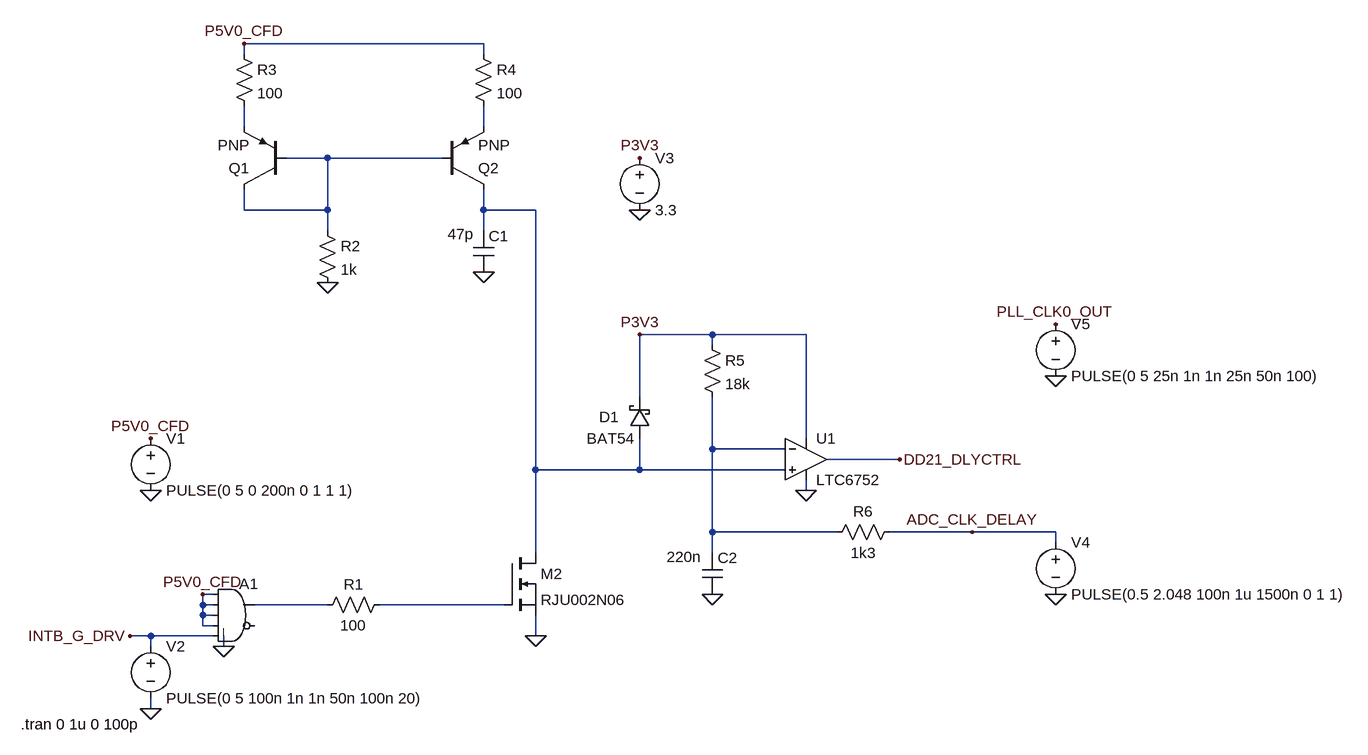
[diagram p0: schematic FIT_PM12_adc_delay.asc]
FIT_PM12_adc_delay.asc, the LTspice schematic file:
Version 4
SHEET 1 1948 680
WIRE 560 -720 192 -720
WIRE 192 -704 192 -720
WIRE 560 -704 560 -720
WIRE 192 -592 192 -624
WIRE 560 -592 560 -624
WIRE 320 -544 256 -544
WIRE 496 -544 320 -544
WIRE 192 -464 192 -496
WIRE 320 -464 320 -544
WIRE 320 -464 192 -464
WIRE 560 -464 560 -496
WIRE 640 -464 560 -464
WIRE 320 -432 320 -464
WIRE 560 -432 560 -464
WIRE 912 -272 800 -272
WIRE 1056 -272 912 -272
WIRE 912 -256 912 -272
WIRE 800 -176 800 -272
WIRE 1056 -112 1056 -272
WIRE 912 -96 912 -176
WIRE 1024 -96 912 -96
WIRE 1200 -80 1088 -80
WIRE 640 -64 640 -464
WIRE 800 -64 800 -112
WIRE 800 -64 640 -64
WIRE 1024 -64 800 -64
WIRE 1056 -32 1056 -48
WIRE 912 32 912 -96
WIRE 1104 32 912 32
WIRE 1312 32 1184 32
WIRE 1440 32 1312 32
WIRE 1440 48 1440 32
WIRE 640 64 640 -64
WIRE 912 64 912 32
WIRE 144 128 128 128
WIRE 128 144 128 128
WIRE 144 144 128 144
WIRE 320 144 208 144
WIRE 592 144 400 144
WIRE 128 160 128 144
WIRE 144 160 128 160
WIRE 128 176 128 160
WIRE 144 176 128 176
WIRE 48 192 16 192
WIRE 144 192 48 192
WIRE 640 192 640 160
WIRE 48 208 48 192
WIRE 160 208 160 192
WIRE 48 304 48 288
FLAG 160 208 0
FLAG 48 -32 0
FLAG 48 -112 P5V0_CFD
FLAG 128 128 P5V0_CFD
FLAG 16 192 INTB_G_DRV
FLAG 48 304 0
FLAG 640 192 0
FLAG 320 -352 0
FLAG 560 -368 0
FLAG 192 -720 P5V0_CFD
FLAG 800 -464 0
FLAG 800 -544 P3V3
FLAG 800 -272 P3V3
FLAG 1056 -32 0
FLAG 1200 -80 DD21_DLYCTRL
FLAG 912 128 0
FLAG 1312 32 ADC_CLK_DELAY
FLAG 1440 128 0
FLAG 1440 -208 0
FLAG 1440 -288 PLL_CLK0_OUT
SYMBOL Digital\\and 176 96 R0
SYMATTR InstName A1
SYMATTR SpiceLine Vhigh=5.0 Vlow=0 Ref=1.0 Td=2ns
SYMBOL voltage 48 -128 R0
WINDOW 123 0 0 Left 0
WINDOW 39 0 0 Left 0
SYMATTR InstName V1
SYMATTR Value PULSE(0 5 0 200n 0 1 1 1)
SYMBOL voltage 48 192 R0
WINDOW 123 0 0 Left 0
WINDOW 39 0 0 Left 0
SYMATTR InstName V2
SYMATTR Value PULSE(0 5 100n 1n 1n 50n 100n 20)
SYMBOL res 416 128 R90
WINDOW 0 0 56 VBottom 2
WINDOW 3 32 56 VTop 2
SYMATTR InstName R1
SYMATTR Value 100
SYMBOL pnp 256 -496 R180
SYMATTR InstName Q1
SYMBOL pnp 496 -496 M180
SYMATTR InstName Q2
SYMBOL res 304 -448 R0
SYMATTR InstName R2
SYMATTR Value 1k
SYMBOL cap 544 -432 R0
WINDOW 3 -39 5 Left 2
SYMATTR Value 47p
SYMATTR InstName C1
SYMBOL res 176 -720 R0
SYMATTR InstName R3
SYMATTR Value 100
SYMBOL res 544 -720 R0
SYMATTR InstName R4
SYMATTR Value 100
SYMBOL schottky 816 -112 R180
WINDOW 0 47 33 Left 2
WINDOW 3 24 0 Left 2
SYMATTR InstName D1
SYMATTR Value BAT54
SYMBOL voltage 800 -560 R0
WINDOW 123 0 0 Left 0
WINDOW 39 0 0 Left 0
SYMATTR InstName V3
SYMATTR Value 3.3
SYMBOL nmos 592 64 R0
SYMATTR InstName M2
SYMATTR Value RJU002N06
SYMBOL Comparators\\LTC6752 1056 -144 R0
SYMATTR InstName U1
SYMBOL res 896 -272 R0
SYMATTR InstName R5
SYMATTR Value 18k
SYMBOL cap 896 64 R0
WINDOW 3 -54 6 Left 2
SYMATTR Value 220n
SYMATTR InstName C2
SYMBOL res 1088 48 R270
WINDOW 0 32 56 VTop 2
WINDOW 3 0 56 VBottom 2
SYMATTR InstName R6
SYMATTR Value 1k3
SYMBOL voltage 1440 32 R0
WINDOW 123 0 0 Left 0
WINDOW 39 0 0 Left 0
SYMATTR InstName V4
SYMATTR Value PULSE(0.5 2.048 100n 1u 1500n 0 1 1)
SYMBOL voltage 1440 -304 R0
WINDOW 123 0 0 Left 0
WINDOW 39 0 0 Left 0
SYMATTR InstName V5
SYMATTR Value PULSE(0 5 25n 1n 1n 25n 50n 100)
TEXT -152 328 Left 2 !.tran 0 1u 0 100p

The netlist it stands for:
* FIT_PM12_adc_delay.asc
A1 P5V0_CFD P5V0_CFD P5V0_CFD P5V0_CFD INTB_G_DRV 0 N006 0 AND Vhigh=5.0 Vlow=0 Ref=1.0 Td=2ns
V1 P5V0_CFD 0 PULSE(0 5 0 200n 0 1 1 1)
V2 INTB_G_DRV 0 PULSE(0 5 100n 1n 1n 50n 100n 20)
R1 N007 N006 100
Q1 N003 N003 N001 0 PNP
Q2 N004 N003 N002 0 PNP
R2 N003 0 1k
C1 N004 0 47p
R3 P5V0_CFD N001 100
R4 P5V0_CFD N002 100
D1 N004 P3V3 BAT54
V3 P3V3 0 3.3
M2 N004 N007 0 0 RJU002N06
XU1 N004 N005 P3V3 0 DD21_DLYCTRL LTC6752  ; pins In+ In- V+ V- OUT
R5 P3V3 N005 18k
C2 N005 0 220n
R6 N005 ADC_CLK_DELAY 1k3
V4 ADC_CLK_DELAY 0 PULSE(0.5 2.048 100n 1u 1500n 0 1 1)
V5 PLL_CLK0_OUT 0 PULSE(0 5 25n 1n 1n 25n 50n 100)
.model D D
.lib standard.dio
.model NPN NPN
.model PNP PNP
.lib standard.bjt
.model NMOS NMOS
.model PMOS PMOS
.lib standard.mos
.tran 0 1u 0 100p
.lib LTC7.lib
.backanno
.end